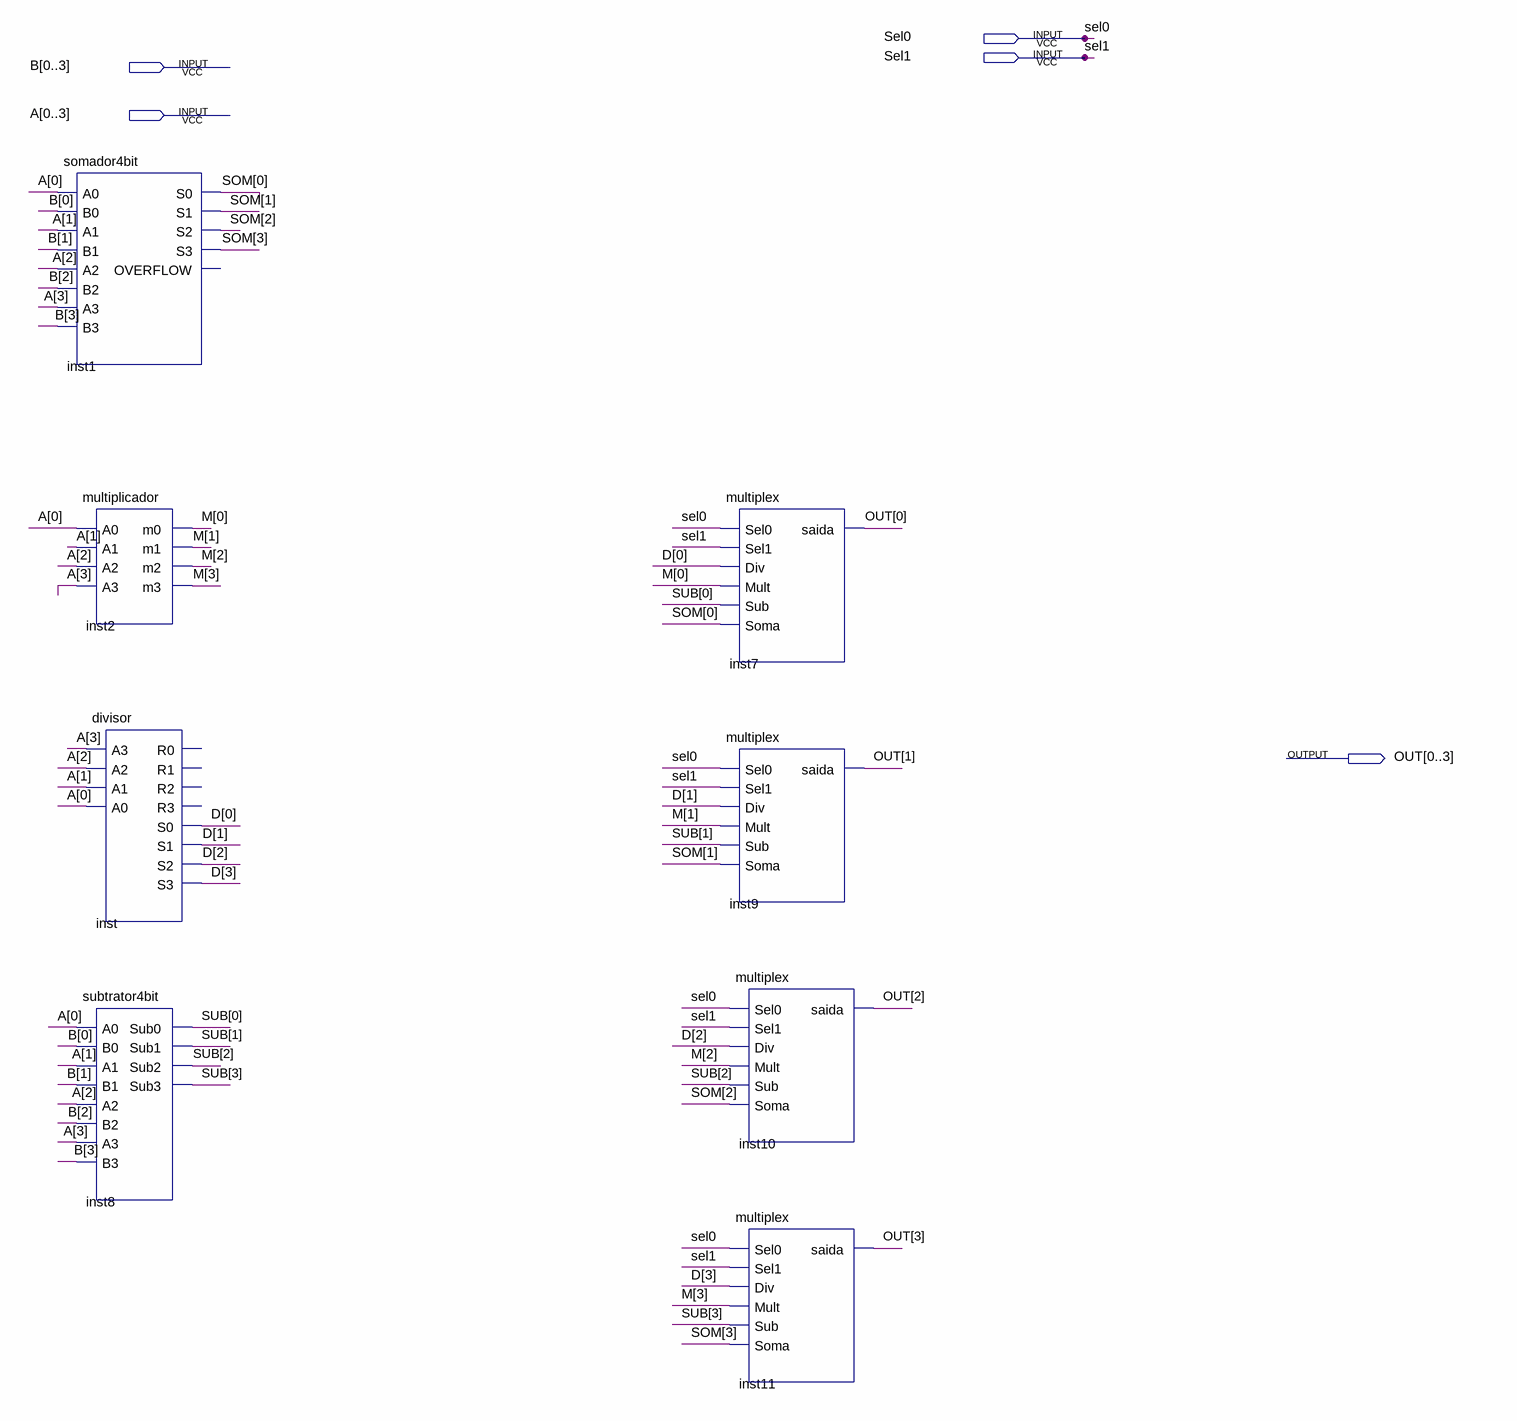
[diagram p0: schematic sheet]
// Quartus schematic ula-ula.bdf as structural Verilog: 8 symbols, 5 pins
module \ula-ula  (
  input  Sel0,
  input  Sel1,
  input  [0:3] B,
  input  [0:3] A,
  output [0:3] OUT
);

  wire [3:0] D, M, SOM, SUB;

  somador4bit inst1 (
    .A0(A[0]), .B0(B[0]), .A1(A[1]), .B1(B[1]), .A2(A[2]), .B2(B[2]), .A3(A[3]), .B3(B[3]), .S0(SOM[0]),
    .S1(SOM[1]), .S2(SOM[2]), .S3(SOM[3]));  // open: OVERFLOW
  multiplicador inst2 (.A0(A[0]), .A1(A[1]), .A2(A[2]), .A3(A[3]), .m0(M[0]), .m1(M[1]), .m2(M[2]), .m3(M[3]));
  divisor inst (
    .A3(A[3]), .A2(A[2]), .A1(A[1]), .A0(A[0]), .S0(D[0]), .S1(D[1]), .S2(D[2]), .S3(D[3]));  // open: R0, R1, R2, R3
  subtrator4bit inst8 (
    .A0(A[0]), .B0(B[0]), .A1(A[1]), .B1(B[1]), .A2(A[2]), .B2(B[2]), .A3(A[3]), .B3(B[3]), .Sub0(SUB[0]),
    .Sub1(SUB[1]), .Sub2(SUB[2]), .Sub3(SUB[3]));
  multiplex inst7 (.Sel0(Sel0), .Sel1(Sel1), .Div(D[0]), .Mult(M[0]), .Sub(SUB[0]), .Soma(SOM[0]), .saida(OUT[0]));
  multiplex inst9 (.Sel0(Sel0), .Sel1(Sel1), .Div(D[1]), .Mult(M[1]), .Sub(SUB[1]), .Soma(SOM[1]), .saida(OUT[1]));
  multiplex inst10 (.Sel0(Sel0), .Sel1(Sel1), .Div(D[2]), .Mult(M[2]), .Sub(SUB[2]), .Soma(SOM[2]), .saida(OUT[2]));
  multiplex inst11 (.Sel0(Sel0), .Sel1(Sel1), .Div(D[3]), .Mult(M[3]), .Sub(SUB[3]), .Soma(SOM[3]), .saida(OUT[3]));
endmodule
